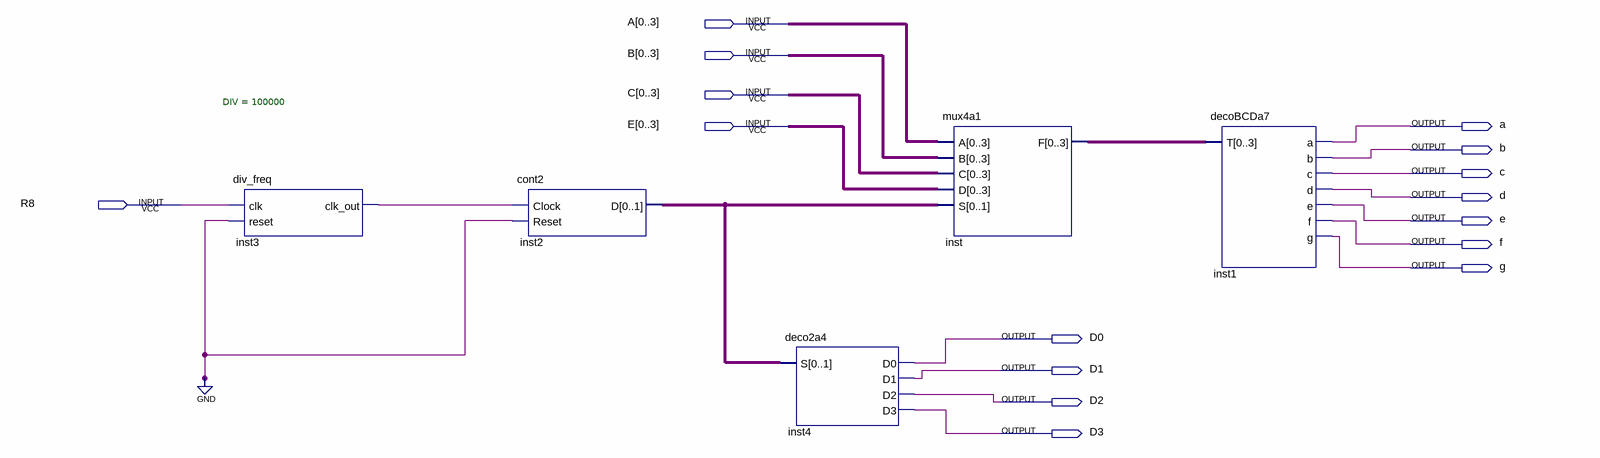
[diagram p0: schematic sheet]
// Quartus schematic Practica2.bdf as structural Verilog: 5 symbols, 16 pins
module Practica2 (
  input  [0:3] A,
  input  [0:3] B,
  input  [0:3] C,
  input  [0:3] E,
  input  R8,
  output A_1bit,
  output B_1bit,
  output C_1bit,
  output d,
  output E_1bit,
  output f,
  output g,
  output D0,
  output D1,
  output D2,
  output D3
);

  wire inst3_clk_out;
  wire [1:0] inst2_d;
  wire [3:0] inst_f;

  div_freq #(.DIV(100000)) inst3 (.clk(R8), .reset(1'b0), .clk_out(inst3_clk_out));
  cont2 inst2 (.Clock(inst3_clk_out), .Reset(1'b0), .D(inst2_d));
  deco2a4 inst4 (.S(inst2_d), .D0(D0), .D1(D1), .D2(D2), .D3(D3));
  mux4a1 inst (.A(A), .B(B), .C(C), .D(E), .S(inst2_d), .F(inst_f));
  decoBCDa7 inst1 (.T(inst_f), .a(A_1bit), .b(B_1bit), .c(C_1bit), .d(d), .e(E_1bit), .f(f), .g(g));
endmodule
